# Altium project FMC_DAC_1_5GS_4CH.PrjPCB (part 4 of 4)
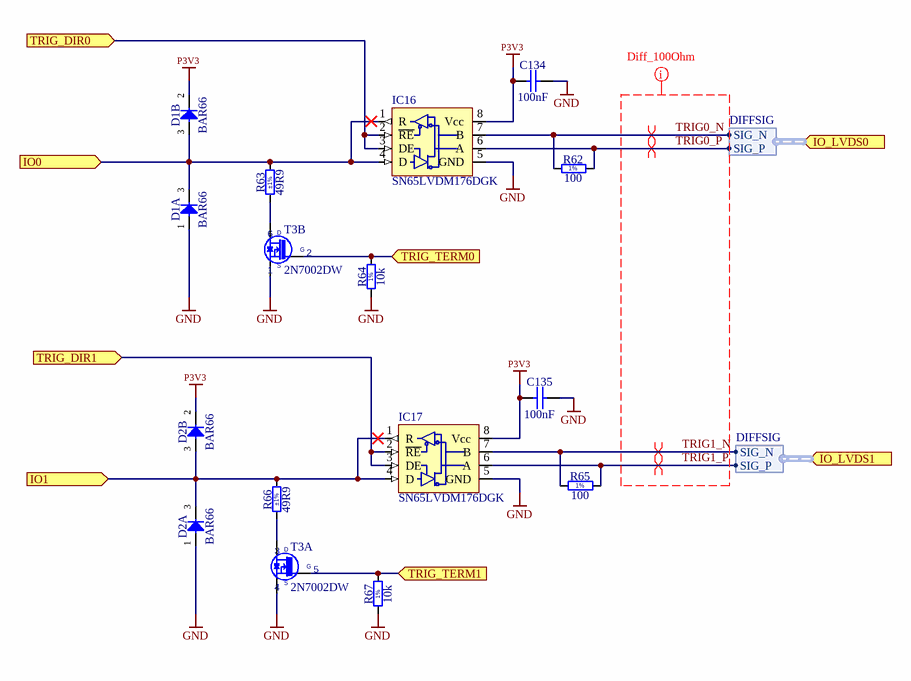
[diagram p10: IO_CTRL.SchDoc]

## Nets that join several sheets
3P3VAUX: DAC_FMC_connector (J2.d32), EEPROM_Temp (11 pins)
GND: FMC_DAC_1_5GS_4CH (12 pins), AWG_PWR_Supply (47 pins), CLK_INPUT (21 pins), DAC (21 pins), DAC_SUPPLY (114 pins), DAC_FMC_connector (164 pins), U_Driver_Filter0 (20 pins), U_Driver_Filter1 (20 pins), U_Driver_Filter2 (20 pins), U_Driver_Filter3 (20 pins), EEPROM_Temp (14 pins), Translators_AWG (30 pins), IO_CTRL (10 pins)
N7V5A: AWG_PWR_Supply (J1.7 J1.8), U_Driver_Filter0 (C120A.2 L15A.2), U_Driver_Filter1 (C120B.2 L15B.2), U_Driver_Filter2 (C120C.2 L15C.2), U_Driver_Filter3 (C120D.2 L15D.2)
P1V2A: AWG_PWR_Supply (5 pins), DAC_SUPPLY (24 pins)
P1V2D: AWG_PWR_Supply (5 pins), DAC_SUPPLY (22 pins)
P3V3: AWG_PWR_Supply (6 pins), CLK_INPUT (LD1.2 LD1.4), DAC (R24.2), DAC_FMC_connector (5 pins), Translators_AWG (8 pins), IO_CTRL (6 pins)
P3V3A: AWG_PWR_Supply (6 pins), CLK_INPUT (L1.1 L2.2), DAC (L3.1), DAC_SUPPLY (L4.2 L6.2 L8.2), Translators_AWG (R61.2)
P7V5A: AWG_PWR_Supply (J1.29 J1.30), U_Driver_Filter0 (C114A.2 L13A.2), U_Driver_Filter1 (C114B.2 L13B.2), U_Driver_Filter2 (C114C.2 L13C.2), U_Driver_Filter3 (C114D.2 L13D.2)
P12V0: AWG_PWR_Supply (J1.3 J1.4), DAC_FMC_connector (J2.c35 J2.c37)
VADJ: FMC_DAC_1_5GS_4CH (R41.2), AWG_PWR_Supply (L10.1), DAC_SUPPLY (L7.2), DAC_FMC_connector (J2.e39 J2.f40 J2.g39 J2.h40)
VADJ_BUF: AWG_PWR_Supply (C103.1 L10.2 R30.2), Translators_AWG (21 pins)
CLK2_BIDIR_N: CLK_INPUT (C13.1), DAC_FMC_connector (J2.k5)
CLK2_BIDIR_P: CLK_INPUT (C11.1), DAC_FMC_connector (J2.k4)
CLK3_BIDIR_N: CLK_INPUT (C15.1), DAC_FMC_connector (J2.j3)
CLK3_BIDIR_P: CLK_INPUT (C14.1), DAC_FMC_connector (J2.j2)
CLK_SEL0: CLK_INPUT (IC1.15 T1.5), Translators_AWG (IC13.14)
CLK_SEL1: CLK_INPUT (IC1.18 T1.2), Translators_AWG (IC13.15)
DAC_ALARM: DAC (U1.N12), DAC_FMC_connector (J2.k35)
DAC_CLK_N: CLK_INPUT (C12.2), DAC (R20.2 U1.A11)
DAC_CLK_P: CLK_INPUT (C10.2), DAC (R20.1 U1.A12)
DAC_RESETB: DAC (R23.1 U1.N10), DAC_FMC_connector (J2.e36)
DAC_SCLK: DAC (B2.1 U1.P9), DAC_FMC_connector (J2.f31)
DAC_SDENB: DAC (B5.1 U1.P10), DAC_FMC_connector (J2.e33)
DAC_SDIO: DAC (B3.1 U1.P11), DAC_FMC_connector (J2.e34)
DAC_SDO: DAC (B4.1 U1.P12), DAC_FMC_connector (J2.j36)
DAC_SLEEP: DAC (R24.1 U1.N11), DAC_FMC_connector (J2.e37)
DAC_TXENA: DAC (B6.1 U1.N9), DAC_FMC_connector (J2.e31)
DATA_CLK_N: DAC (U1.G1), DAC_FMC_connector (J2.h23)
DATA_CLK_P: DAC (U1.G2), DAC_FMC_connector (J2.h22)
DRV_DIS0: U_Driver_Filter0 (IC7A.10), Translators_AWG (IC11.15)
DRV_DIS1: U_Driver_Filter1 (IC7B.10), Translators_AWG (IC11.14)
DRV_DIS2: U_Driver_Filter2 (IC7C.10), Translators_AWG (IC11.13)
DRV_DIS3: U_Driver_Filter3 (IC7D.10), Translators_AWG (IC11.12)
DRV_DIS_VADJ0: DAC_FMC_connector (J2.j7), Translators_AWG (IC11.6)
DRV_DIS_VADJ1: DAC_FMC_connector (J2.f8), Translators_AWG (IC11.7)
DRV_DIS_VADJ2: DAC_FMC_connector (J2.f7), Translators_AWG (IC11.8)
DRV_DIS_VADJ3: DAC_FMC_connector (J2.j6), Translators_AWG (IC11.9)
GA0: DAC_FMC_connector (J2.c34), EEPROM_Temp (IC10.2)
GA1: DAC_FMC_connector (J2.d35), EEPROM_Temp (IC10.1)
HA00_CC_N: CLK_INPUT (C9.2), DAC_FMC_connector (J2.f5)
HA00_CC_P: CLK_INPUT (C8.2), DAC_FMC_connector (J2.f4)
HA01_CC_N: DAC_FMC_connector (J2.e3), Translators_AWG (IC15.4 R60.1)
HA01_CC_P: DAC_FMC_connector (J2.e2), Translators_AWG (IC15.3 R59.1)
HA02_N: DAC_FMC_connector (J2.k8), Translators_AWG (IC14.8)
HA02_P: DAC_FMC_connector (J2.k7), Translators_AWG (IC14.9)
HA05_P: AWG_PWR_Supply (6 pins), DAC_FMC_connector (J2.e6), EEPROM_Temp (IC8.3 IC9.3)
HA06_N: DAC_FMC_connector (J2.k11), Translators_AWG (IC12.6)
HA06_P: DAC_FMC_connector (J2.k10), Translators_AWG (IC14.6)
HA07_P: DAC_FMC_connector (J2.j9), Translators_AWG (IC14.7)
HA10_N: DAC (C33.1), DAC_FMC_connector (J2.k14)
HA10_P: DAC (C31.1), DAC_FMC_connector (J2.k13)
HA11_P: DAC_FMC_connector (J2.j12), Translators_AWG (IC12.9)
HA12_N: DAC_FMC_connector (J2.f14), Translators_AWG (IC12.7)
HA12_P: DAC_FMC_connector (J2.f13), Translators_AWG (IC12.8)
HA13_N: DAC_FMC_connector (J2.e13), Translators_AWG (IC13.8 R68.2)
HA16_N: DAC_FMC_connector (J2.e16), Translators_AWG (IC13.6 R57.2)
HA16_P: DAC_FMC_connector (J2.e15), Translators_AWG (IC13.7 R58.1)
HA22_N: DAC (U1.P8), DAC_FMC_connector (J2.j22)
HA22_P: DAC (U1.N8), DAC_FMC_connector (J2.j21)
HB00_CC_N: DAC (U1.H1), DAC_FMC_connector (J2.k26)
HB00_CC_P: DAC (U1.H2), DAC_FMC_connector (J2.k25)
HB08_N: FMC_DAC_1_5GS_4CH (R43.1), DAC_FMC_connector (J2.f29)
HB08_P: FMC_DAC_1_5GS_4CH (R42.1), DAC_FMC_connector (J2.f28)
HB09_N: FMC_DAC_1_5GS_4CH (R41.1), DAC_FMC_connector (J2.e28)
HB13_P: FMC_DAC_1_5GS_4CH (R44.1), DAC_FMC_connector (J2.e30)
HB17_CC_N: DAC_FMC_connector (J2.k38), IO_CTRL (IC17.7 R65.1)
HB17_CC_P: DAC_FMC_connector (J2.k37), IO_CTRL (IC17.6 R65.2)
HB20_N: DAC_FMC_connector (J2.f38), IO_CTRL (IC16.7 R62.1)
HB20_P: DAC_FMC_connector (J2.f37), IO_CTRL (IC16.6 R62.2)
IOUTA_N: DAC (R13.1 U1.C14), U_Driver_Filter0 (IC7A.3 R48A.2)
IOUTA_P: DAC (R12.1 U1.B14), U_Driver_Filter0 (IC7A.2 R46A.1)
IOUTB_N: DAC (R15.1 U1.E14), U_Driver_Filter1 (IC7B.3 R48B.2)
IOUTB_P: DAC (R14.1 U1.F14), U_Driver_Filter1 (IC7B.2 R46B.1)
IOUTC_N: DAC (R17.1 U1.K14), U_Driver_Filter2 (IC7C.3 R48C.2)
IOUTC_P: DAC (R16.1 U1.J14), U_Driver_Filter2 (IC7C.2 R46C.1)
IOUTD_N: DAC (R19.1 U1.M14), U_Driver_Filter3 (IC7D.3 R48D.2)
IOUTD_P: DAC (R18.1 U1.N14), U_Driver_Filter3 (IC7D.2 R46D.1)
LA00_CC_N: DAC (U1.B8), DAC_FMC_connector (J2.g7)
LA00_CC_P: DAC (U1.A8), DAC_FMC_connector (J2.g6)
LA01_CC_N: DAC (U1.B7), DAC_FMC_connector (J2.d9)
LA01_CC_P: DAC (U1.A7), DAC_FMC_connector (J2.d8)
LA02_N: DAC (U1.B4), DAC_FMC_connector (J2.h8)
LA02_P: DAC (U1.A4), DAC_FMC_connector (J2.h7)
LA03_N: DAC (U1.B3), DAC_FMC_connector (J2.g10)
LA03_P: DAC (U1.A3), DAC_FMC_connector (J2.g9)
LA04_N: DAC (U1.B2), DAC_FMC_connector (J2.h11)
LA04_P: DAC (U1.A2), DAC_FMC_connector (J2.h10)
LA05_N: DAC (U1.B5), DAC_FMC_connector (J2.d12)
LA05_P: DAC (U1.A5), DAC_FMC_connector (J2.d11)
LA06_N: DAC (U1.B6), DAC_FMC_connector (J2.c11)
LA06_P: DAC (U1.A6), DAC_FMC_connector (J2.c10)
LA07_N: DAC (U1.C1), DAC_FMC_connector (J2.h14)
LA07_P: DAC (U1.C2), DAC_FMC_connector (J2.h13)
LA08_N: DAC (U1.B1), DAC_FMC_connector (J2.g13)
LA08_P: DAC (U1.A1), DAC_FMC_connector (J2.g12)
LA09_N: DAC (U1.D3), DAC_FMC_connector (J2.d15)
LA09_P: DAC (U1.D4), DAC_FMC_connector (J2.d14)
LA10_N: DAC (U1.C3), DAC_FMC_connector (J2.c15)
LA10_P: DAC (U1.C4), DAC_FMC_connector (J2.c14)
LA11_N: DAC (U1.E1), DAC_FMC_connector (J2.h17)
LA11_P: DAC (U1.E2), DAC_FMC_connector (J2.h16)
LA12_N: DAC (U1.D1), DAC_FMC_connector (J2.g16)
LA12_P: DAC (U1.D2), DAC_FMC_connector (J2.g15)
LA13_N: DAC (U1.E3), DAC_FMC_connector (J2.d18)
LA13_P: DAC (U1.E4), DAC_FMC_connector (J2.d17)
LA14_N: DAC (U1.G3), DAC_FMC_connector (J2.c19)
LA14_P: DAC (U1.G4), DAC_FMC_connector (J2.c18)
LA15_N: DAC (U1.F1), DAC_FMC_connector (J2.h20)
LA15_P: DAC (U1.F2), DAC_FMC_connector (J2.h19)
LA16_N: DAC (U1.F3), DAC_FMC_connector (J2.g19)
LA16_P: DAC (U1.F4), DAC_FMC_connector (J2.g18)
LA17_CC_N: DAC (U1.H3), DAC_FMC_connector (J2.d21)
LA17_CC_P: DAC (U1.H4), DAC_FMC_connector (J2.d20)
LA18_CC_N: DAC (U1.K3), DAC_FMC_connector (J2.c23)
LA18_CC_P: DAC (U1.K4), DAC_FMC_connector (J2.c22)
LA20_N: DAC (U1.J3), DAC_FMC_connector (J2.g22)
LA20_P: DAC (U1.J4), DAC_FMC_connector (J2.g21)
LA21_N: DAC (U1.P1), DAC_FMC_connector (J2.h26)
LA21_P: DAC (U1.N1), DAC_FMC_connector (J2.h25)
LA22_N: DAC (U1.M3), DAC_FMC_connector (J2.g25)
LA22_P: DAC (U1.M4), DAC_FMC_connector (J2.g24)
LA23_N: DAC (U1.L3), DAC_FMC_connector (J2.d24)
LA23_P: DAC (U1.L4), DAC_FMC_connector (J2.d23)
LA24_N: DAC (U1.J1), DAC_FMC_connector (J2.h29)
LA24_P: DAC (U1.J2), DAC_FMC_connector (J2.h28)
LA25_N: DAC (U1.P4), DAC_FMC_connector (J2.g28)
LA25_P: DAC (U1.N4), DAC_FMC_connector (J2.g27)
LA26_N: DAC (U1.P3), DAC_FMC_connector (J2.d27)
LA26_P: DAC (U1.N3), DAC_FMC_connector (J2.d26)
LA27_N: DAC (U1.P2), DAC_FMC_connector (J2.c27)
LA27_P: DAC (U1.N2), DAC_FMC_connector (J2.c26)
LA28_N: DAC (U1.K1), DAC_FMC_connector (J2.h32)
LA28_P: DAC (U1.K2), DAC_FMC_connector (J2.h31)
LA29_N: DAC (U1.P5), DAC_FMC_connector (J2.g31)
LA29_P: DAC (U1.N5), DAC_FMC_connector (J2.g30)
LA30_N: DAC (U1.L1), DAC_FMC_connector (J2.h35)
LA30_P: DAC (U1.L2), DAC_FMC_connector (J2.h34)
LA31_N: DAC (U1.P6), DAC_FMC_connector (J2.g34)
LA31_P: DAC (U1.N6), DAC_FMC_connector (J2.g33)
LA32_N: DAC (U1.P7), DAC_FMC_connector (J2.h38)
LA32_P: DAC (U1.N7), DAC_FMC_connector (J2.h37)
LA33_N: DAC (U1.M1), DAC_FMC_connector (J2.g37)
LA33_P: DAC (U1.M2), DAC_FMC_connector (J2.g36)
LPF_EN0: U_Driver_Filter0 (IC7A.4), Translators_AWG (IC12.12)
LPF_EN1: U_Driver_Filter1 (IC7B.4), Translators_AWG (IC12.13)
LPF_EN2: U_Driver_Filter2 (IC7C.4), Translators_AWG (IC12.15)
LPF_EN3: U_Driver_Filter3 (IC7D.4), Translators_AWG (IC12.14)
NetC6_2: FMC_DAC_1_5GS_4CH (J5.1), CLK_INPUT (C6.2)
NetD1_3: FMC_DAC_1_5GS_4CH (J8.1), IO_CTRL (D1.3 IC16.1 IC16.4 R63.2)
NetD2_3: FMC_DAC_1_5GS_4CH (J9.1), IO_CTRL (D2.3 IC17.1 IC17.4 R66.2)
NetIC13_13: CLK_INPUT (R8.1), Translators_AWG (IC13.13)
NetIC14_12: Translators_AWG (IC14.12), IO_CTRL (R67.2 T3.5)
NetIC14_13: Translators_AWG (IC14.13), IO_CTRL (R64.2 T3.2)
NetIC14_14: Translators_AWG (IC14.14), IO_CTRL (IC17.2 IC17.3)
NetIC14_15: Translators_AWG (IC14.15), IO_CTRL (IC16.2 IC16.3)
NetIC15_5: CLK_INPUT (OSC1.7 R1.1 TP1.1), Translators_AWG (IC15.5)
NetIC15_6: CLK_INPUT (OSC1.8 R2.1 TP2.1), Translators_AWG (IC15.6)
NetJ3_1: FMC_DAC_1_5GS_4CH (J3.1), U_Driver_Filter0 (R47A.2)
NetJ4_1: FMC_DAC_1_5GS_4CH (J4.1), U_Driver_Filter1 (R47B.2)
NetJ6_1: FMC_DAC_1_5GS_4CH (J6.1), U_Driver_Filter2 (R47C.2)
NetJ7_1: FMC_DAC_1_5GS_4CH (J7.1), U_Driver_Filter3 (R47D.2)
PG_M2C: AWG_PWR_Supply (6 pins), DAC_FMC_connector (J2.f1)
SCL: DAC_FMC_connector (J2.c30), EEPROM_Temp (B12.1 IC10.6 R54.2 R56.1)
SDA: DAC_FMC_connector (J2.c31), EEPROM_Temp (B11.1 IC10.5 R53.2 R55.1)
SG0: FMC_DAC_1_5GS_4CH (C109.1 J5.2 R39.2 R40.2), CLK_INPUT (TR1.4)

## Assembly variants
Standard: not fitted IC16 R5